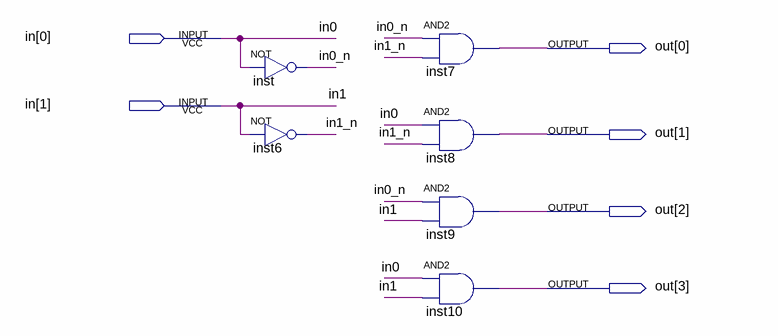
[diagram p0: schematic sheet]
// Quartus schematic 2-4Decoder.bdf as structural Verilog: 6 symbols, 6 pins
module \2-4Decoder  (
  input  [1:0] in,
  output [3:0] out
);

  wire in0_n, in1_n;

  not inst (in0_n, in[0]);
  not inst6 (in1_n, in[1]);
  and inst7 (out[0], in0_n, in1_n);
  and inst8 (out[1], in[0], in1_n);
  and inst9 (out[2], in0_n, in[1]);
  and inst10 (out[3], in[0], in[1]);
endmodule
